# EasyEDA Pro project TLC5620.eprj

# Schematic Schematic1
Board Name: Board1; Create Date: 2025-03-31; Page Name: P1; Project Name: shiboqi; Schematic Name: Schematic1; Update Date: 2025-03-31; Company: 嘉立创EDA; Page Size: A4; Version: V1.0
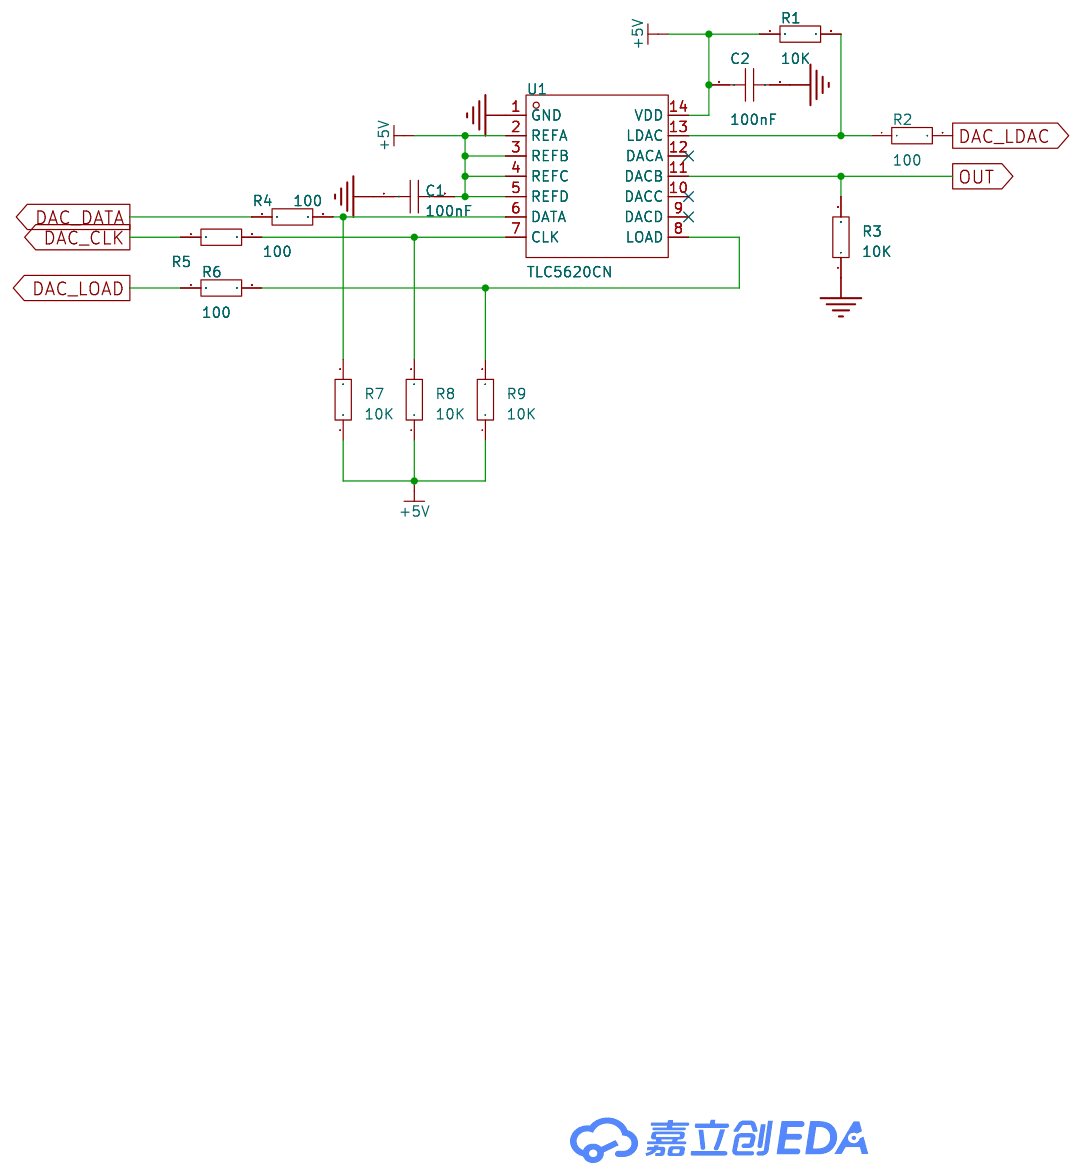
[diagram p0: schematic sheet]

## Parts
C1  100nF  [C0603]
C2  100nF  [C0603]
R1  10K  [R0603]
R2  100  [R0603]
R3  10K  [R0603]
R4  100  [R0603]
R5  100  [R0603]
R6  100  [R0603]
R7  10K  [R0603]
R8  10K  [R0603]
R9  10K  [R0603]
U1  TLC5620CN  [DIP-14_L19.0-W7.0-P2.54-LS7.6-BL]

## Library data of the parts
C1 C2 = CAP_0603: Supplier Footprint: 0603
R1-R9 = Res_0603: Supplier Footprint: 0603
U1 = TLC5620CN: Supplier Part: C5341; Manufacturer: TI(德州仪器); Supplier Footprint: PDIP-14; JLCPCB Part Class: 扩展库; Datasheet: https://www.ti.com/cn/lit/gpn/tlc5620; Supplier: LCSC; Interface: SPI; Output Type: 电压-缓冲; Supply Voltage: 5V; Resolution: 8位; Integral nonlinearity: ±0.9LSB；±1LSB; Settling Time: 10us; Operating Temperature: 0℃~+70℃

## Nets
+5V: C1.2 C2.1 R1.1 R7.1 R8.1 R9.1 U1.2(REFA) U1.3(REFB) U1.4(REFC) U1.5(REFD) U1.14(VDD)
GND: C1.1 C2.2 R3.1 U1.1(GND)
DAC_CLK: R5.1
DAC_DATA: R4.1
DAC_LDAC: R2.2
DAC_LOAD: R6.1
OUT: R3.2 U1.11(DACB)
$1N677: R1.2 R2.1 U1.13(LDAC)
$1N925: R4.2 R7.2 U1.6(DATA)
$1N979: R5.2 R8.2 U1.7(CLK)
$1N1031: R6.2 R9.2 U1.8(LOAD)

Not connected (* = marked no-connect by the designer): U1 9(DACD)* 10(DACC)* 12(DACA)*

# Board PCB1
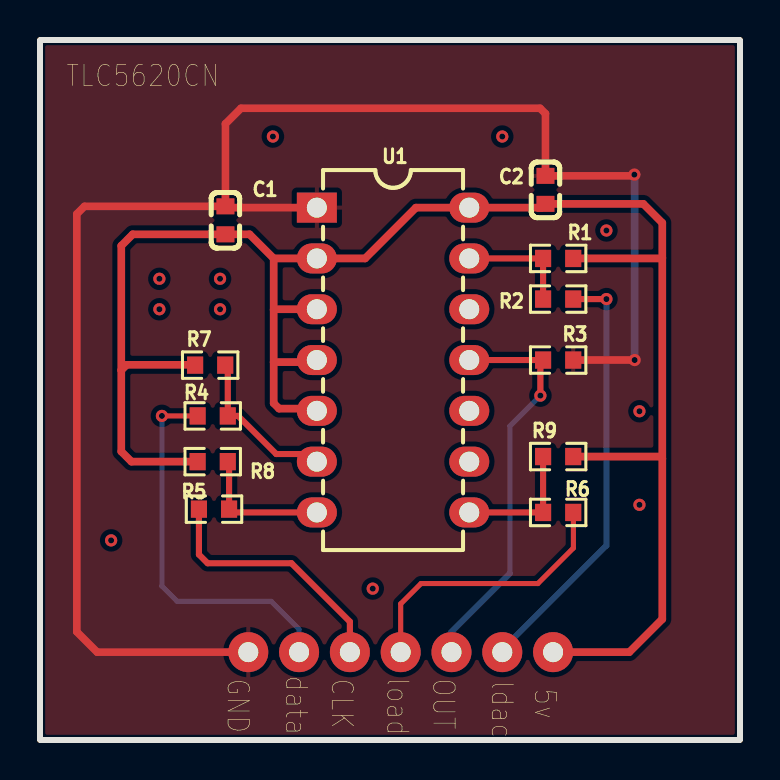
[diagram p1: board, top side]
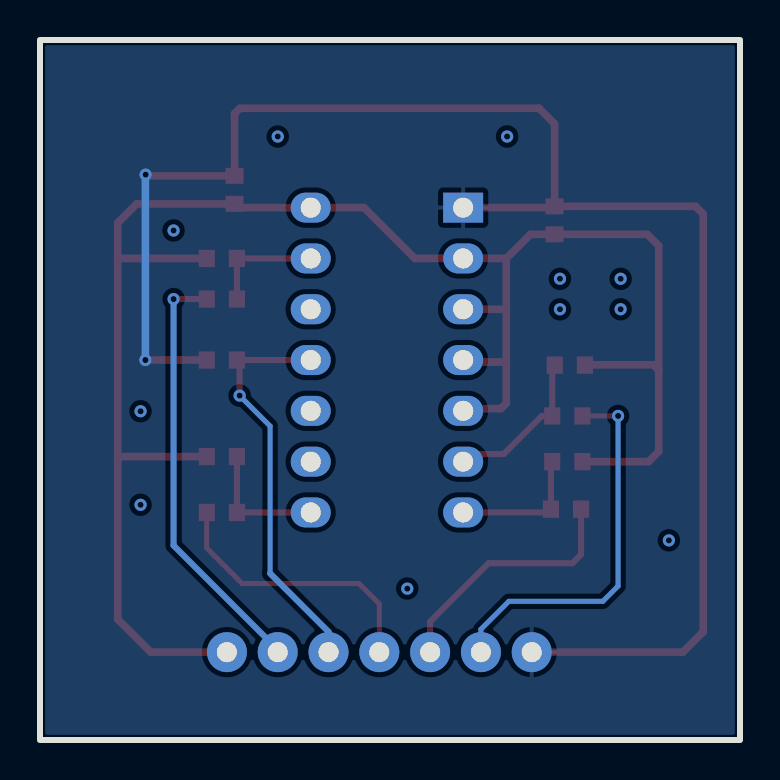
[diagram p2: board, bottom side, seen from below]

Outline 35 x 35 mm; copper layers: Top Layer, Bottom Layer. Coordinates in mm from the lower left corner of the outline.
Outline path: rectangle 0,35 35,0
Stack: Top Layer 0.035mm / Dielectric1 1.51mm FR4 er 4.5 / Bottom Layer 0.035mm

## Design rules (mm)
template: JLCPCB Capability(Two Layers Board)
spacing copperThickness1oz (default): track to track 0.102, other pairs 0.152 to 0.3
spacing copperThickness2oz: track to track 0.203, other pairs 0.152 to 0.3
track width copperThickness1oz (default): min 0.127, default 0.254, max 2.54
track width copperThickness2oz: min 0.203, default 0.254, max 2.54
differential pair differentialPair (default): width min 0.127, default 0.254, max 2.54; gap min 0.152, default 0.152
via viaSize (default): diameter min 0.5, default 0.61, max 10; hole min 0.3, default 0.305, max 6.3

## Placement (name value [footprint] x y rotation side)
C1  100nF  [C0603]  9.27 25.98 270 top
C2  100nF  [C0603]  25.27 27.51 90 top
NOREF  -  [Pad_e40]  23.11 4.39 0 top
NOREF#2  -  [Pad_e38]  18.03 4.39 0 top
NOREF#3  -  [Pad_e28]  10.41 4.39 0 top
NOREF#4  -  [Pad_e36]  12.95 4.39 0 top
NOREF#5  -  [Pad_e41]  25.65 4.39 0 top
NOREF#6  -  [Pad_e39]  20.57 4.39 0 top
NOREF#7  -  [Pad_e37]  15.49 4.39 0 top
R1  10K  [R0603]  25.91 24.08 180 top
R2  100  [R0603]  25.91 22.05 0 top
R3  10K  [R0603]  25.91 19 180 top
R4  100  [R0603]  8.64 16.2 0 top
R5  100  [R0603]  8.7 11.54 0 top
R6  100  [R0603]  25.91 11.38 180 top
R7  10K  [R0603]  8.51 18.74 0 top
R8  10K  [R0603]  8.64 13.92 0 top
R9  10K  [R0603]  25.91 14.17 180 top
U1  TLC5620CN  [DIP-14_L19.0-W7.0-P2.54-LS7.6-BL]  17.65 19 270 top

## Footprints (pads in the part's own frame, mm; a bottom-side part is the same pattern mirrored in y, then rotated)
C0603
  rect 0.8x0.9 smd: 1(-0.7,0) 2(0.7,0)
DIP-14_L19.0-W7.0-P2.54-LS7.6-BL
  rect 1.5x2 hole 1: 1(-7.62,-3.81)
  oval 1.5x2 hole 1: 2(-5.08,-3.81) 3(-2.54,-3.81) 4(0,-3.81) 5(2.54,-3.81) 6(5.08,-3.81) 7(7.62,-3.81) 8(7.62,3.81) 9(5.08,3.81) 10(2.54,3.81) 11(0,3.81) 12(-2.54,3.81) 13(-5.08,3.81) 14(-7.62,3.81)
Pad_e28
  round 2 hole 1: 1(0,0)
Pad_e36
  round 2 hole 1: 2(0,0)
Pad_e37
  round 2 hole 1: 15(0,0)
Pad_e38
  round 2 hole 1: 16(0,0)
Pad_e39
  round 2 hole 1: 17(0,0)
Pad_e40
  round 2 hole 1: 18(0,0)
Pad_e41
  round 2 hole 1: 19(0,0)
R0603
  rect 0.806x0.864 smd: 1(-0.753,0) 2(0.753,0)

## Nets
+5V: C1.2 C2.1 NOREF#5.19 R1.1 R7.1 R8.1 R9.1 U1.2 U1.3 U1.4 U1.5 U1.14
GND: C1.1 C2.2 NOREF#3.1 R3.1 U1.1
DAC_CLK: NOREF#7.15 R5.1
DAC_DATA: NOREF#4.2 R4.1
DAC_LDAC: NOREF.18 R2.2
DAC_LOAD: NOREF#2.16 R6.1
OUT: NOREF#6.17 R3.2 U1.11
$1N677: R1.2 R2.1 U1.13
$1N925: R4.2 R7.2 U1.6
$1N979: R5.2 R8.2 U1.7
$1N1031: R6.2 R9.2 U1.8

Pads without a net: U1 9 10 12

## Via types
v1: diameter 0.61, hole 0.305, Top Layer to Bottom Layer, 16 vias

## Routing (per net, layer and track width the routed paths; a pad name or vN(x,y) marks a point on that pad's centre or on a via; arc(x,y) is an arc through that point)
+5V: length 96.3
  Top Layer w0.381: NOREF#5.19 29.46,4.39 31.12,6.04 31.12,14.07 ; 11.68,24.08 10.48,25.28 C1.2 4.64,25.28 4.06,24.71 4.06,18.49 ; 11.68,24.08 11.68,21.51 ; 11.68,24.08 U1.2 16.26,24.08 18.8,26.62 U1.14 25.08,26.62 C2.1 30.16,26.81 31.12,25.86 31.12,24.1 ; 31.12,24.1 31.12,14.07 ; 31.12,24.1 31.09,24.08 R1.1 ; 31.12,14.07 31.01,14.17 R9.1 ; 11.68,18.89 11.68,16.84 11.95,16.57 13.73,16.57 U1.5 ; 11.68,18.89 13.74,18.89 U1.4 ; 11.68,18.89 11.68,21.51 ; R8.1 4.57,13.92 4.06,14.43 4.06,18.49 ; 11.68,21.51 11.71,21.54 U1.3 ; 4.06,18.49 4.33,18.76 7.74,18.76 R7.1
GND: length 82.6
  Top Layer w0.381: U1.1 9.34,26.62 C1.1 ; v1(29.72,28.27) 29.66,28.21 C2.2 25.27,31.32 25,31.59 10.05,31.59 9.27,30.81 C1.1 ; C1.1 2.22,26.68 1.84,26.3 1.84,5.41 2.86,4.39 NOREF#3.1 ; R3.1 v1(29.73,19)
  Bottom Layer w0.381: v1(29.73,19) 29.73,28.26 v1(29.72,28.27)
(no net):
  vias: v1(3.56,9.98) v1(5.97,23.06) v1(5.97,21.54) v1(9,23.06) v1(9,21.54) v1(11.65,30.17) v1(16.64,7.57) v1(23.11,30.17) v1(28.32,25.47) v1(29.97,16.44) v1(29.97,11.76)
DAC_CLK: length 12.7
  Top Layer w0.305: NOREF#7.15 15.49,5.92 12.57,8.84 8.38,8.84 7.95,9.27 R5.1
DAC_DATA: length 19.2
  Top Layer w0.254: R4.1 v1(6.1,16.2)
  Bottom Layer w0.254: NOREF#4.2 12.95,5.54 11.56,6.93 6.86,6.93 6.1,7.69 v1(6.1,16.2)
DAC_LDAC: length 21.5
  Top Layer w0.305: R2.2 v1(28.32,22.05)
  Bottom Layer w0.305: NOREF.18 23.11,4.52 28.32,9.73 v1(28.32,22.05)
DAC_LOAD: length 14
  Top Layer w0.254: NOREF#2.16 18.03,6.81 19.05,7.82 24.89,7.82 26.67,9.6 26.67,11.37 R6.1
OUT: length 20.2
  Top Layer w0.305: v1(25.02,17.22) 25.02,18.86 R3.2 U1.11
  Bottom Layer w0.254: v1(25.02,17.22) 23.5,15.7 23.5,8.33
  Bottom Layer w0.305: NOREF#6.17 20.57,5.41 23.5,8.33
$1N677: length 5.7
  Top Layer w0.305: R2.1 R1.2 U1.13
$1N925: length 8
  Top Layer w0.305: R7.2 9.39,18.62 R4.2 9.91,16.2 11.81,14.3 13.46,14.3 U1.6
$1N979: length 6.9
  Top Layer w0.305: R8.2 9.45,13.85 R5.2 9.62,11.38 U1.7
$1N1031: length 6.5
  Top Layer w0.305: U1.8 R6.2 R9.2

## Copper pours and planes (outline as drawn; the poured copper is in the pictures)
GND on Top Layer: 0,35 35,35 35,0 0,0
GND on Bottom Layer: 0,35 35,35 35,0 0,0

## Text on the board
Top Silkscreen Layer: TLC5620CN | GND | data | CLK | load | OUT | ldac | 5v
